# Altium schematic sheet CAN.SchDoc
size A; SheetNumber: 3; SheetTotal: 8
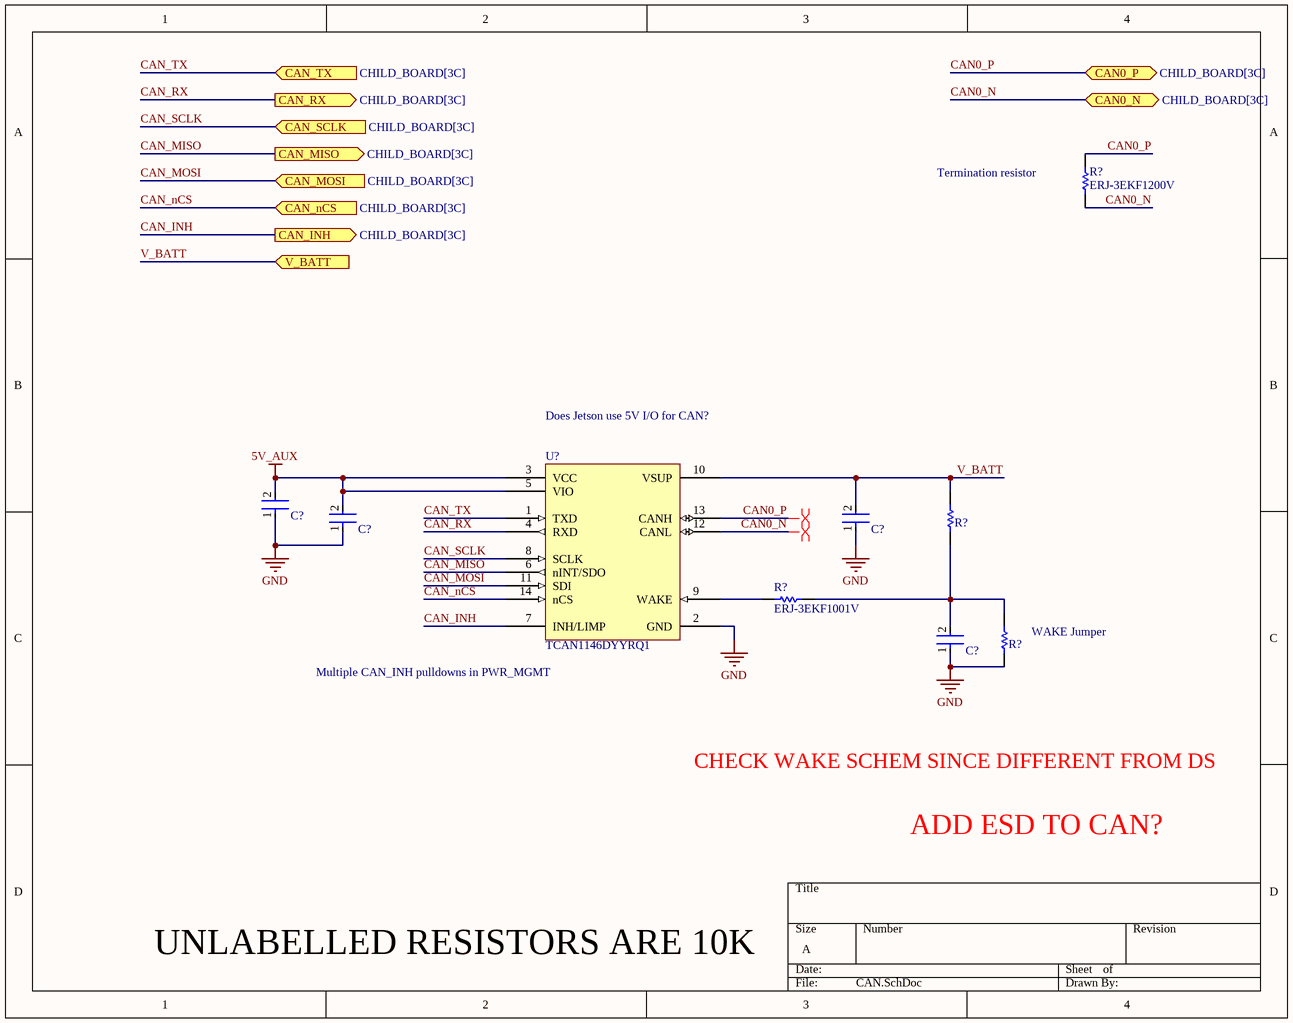
[diagram p0: CAN.SchDoc]

## Parts
(Parts that share a designator on the sheet are numbered #1, #2 ... from top to bottom, then left to right.)
C?#1  C0402C104K8PACTU  [FP-C0402-BB-MFG]  (value not drawn)
C?#2  C0402C104K8PACTU  [FP-C0402-BB-MFG]  (value not drawn)
C?#3  C0402C104K8PACTU  [FP-C0402-BB-MFG]  (value not drawn)
C?#4  C0402C104K8PACTU  [FP-C0402-BB-MFG]  (value not drawn)
R?#1  ERJ-3EKF1200V  [RESC1609X55X30ML15T15]
R?#2  ERJ3EKF1002V  [RESC1609X55X30LL15T15]  (value not drawn)
R?#3  ERJ-3EKF1001V  [RESC1608X55X30LL15T15]
R?#4  0402 JUMPER 0 OHM  [RESC1005X40X25NL05T05]  (value not drawn)
U?  TCAN1146DYYRQ1  [TCAN1146DYYRQ1-Footprint-1]

## Ports
CAN0_N (bidir, see CHILD_BOARD[3C]), CAN0_P (bidir, see CHILD_BOARD[3C]), CAN_INH (out, see CHILD_BOARD[3C]), CAN_MISO (out, see CHILD_BOARD[3C]), CAN_MOSI (in, see CHILD_BOARD[3C]), CAN_nCS (in, see CHILD_BOARD[3C]), CAN_RX (out, see CHILD_BOARD[3C]), CAN_SCLK (in, see CHILD_BOARD[3C]), CAN_TX (in, see CHILD_BOARD[3C]), V_BATT (in)

## Nets
5V_AUX: C?#1.2 C?#2.2 U?.3(VCC) U?.5(VIO)
GND: C?#1.1 C?#2.1 C?#3.1 C?#4.1 R?#4.1 U?.2(GND)
CAN0_N: R?#1.1 U?.12(CANL) ; port CAN0_N
CAN0_P: R?#1.2 U?.13(CANH) ; port CAN0_P
CAN_INH: U?.7(INH/LIMP) ; port CAN_INH
CAN_MISO: U?.6(nINT/SDO) ; port CAN_MISO
CAN_MOSI: U?.11(SDI) ; port CAN_MOSI
CAN_nCS: U?.14(nCS) ; port CAN_nCS
CAN_RX: U?.4(RXD) ; port CAN_RX
CAN_SCLK: U?.8(SCLK) ; port CAN_SCLK
CAN_TX: U?.1(TXD) ; port CAN_TX
V_BATT: C?#3.2 R?#2.1 U?.10(VSUP) ; port V_BATT
NetC?#4_2: C?#4.2 R?#2.2 R?#3.2 R?#4.2
NetR?#3_1: R?#3.1 U?.9(WAKE)

## Layout directives
differential pair: CAN0_N, CAN0_P

## Notes on the sheet
- (near R?#1) Termination resistor
- Does Jetson use 5V I/O for CAN?
- (near R?#4) WAKE Jumper
- (near U?) Multiple CAN_INH pulldowns in PWR_MGMT
- CHECK WAKE SCHEM SINCE DIFFERENT FROM DS
- ADD ESD TO CAN?
- UNLABELLED RESISTORS ARE 10K

## Library data of the parts
C?#1-C?#4 = CMP-2008-02046-2: CAP CER 0.1UF 10V X5R 0402; Manufacturer: Kemet; Material: Ceramic; Capacitance: 0.10 μF; Temperature Coefficient: 15%; Tolerance: 0.1; Value: 0.10 μF; Package: C0402-BB; Temperature: -55°C to +125°C; ComponentLink2Description: Datasheet; Temperature Characteristic: X5R; Device Class L1: Passive Components; Height: 0.55mm; Lead Free: Yes; ComponentLink2URL: https://content.kemet.com/datasheets/KEM_C1002_X7R_SMD.pdf; Device Class L2: Capacitors; Temperature Range Low: -55°C; Temperature Range High: +125°C; RoHS: TRUE; Octopart: https://octopart.com/c0402c104k8pactu-kemet-140039; Automotive: No; Mouser Description: Capacitor 100 nF 10 VDC 0402; Category: Cap; Voltage Rating: 10 V; Digikey Description: CAP CER 0.1UF 10V X5R 0402; Ipc Land Pattern Name: CAPC10050X50; Device Class L3: Ceramic Capacitors; Manufacturer Part Number: C0402C104K8PACTU
R?#1 = CMP-2000-00213-2: Chip Resistor, 120 Ohm, +/- 1%, 0.1 W, -55 to 155 degC, 0603 (1608 Metric), RoHS, Tape and Reel; Manufacturer: Panasonic; Power Rating: 100mW; Voltage Rating (DC): 75V; Resistance: 120Ohm; Temperature Coefficient: 100ppm/degreesC; Number of Terminations: 2; Military Standard: Not; Tolerance: 1%; Min Operating Temperature: -55degC; Packaging: TapeandReel; Lead Free: LeadFree; Max Operating Temperature: 155degC; Manufacturer URL: http://www.panasonic.com/; Case Code (Imperial): 0603; REACH SVHC: NoSVHC; Width: 0.031inch; Datasheet URL: https://industrial.panasonic.com/cdbs/www-data/pdf/RDA0000/AOA0000C283.pdf; RoHSCompliant: true; Max Power Dissipation: 100mW; Termination: SMD/SMT; Package Reference: 0603; Height: 0.022inch; Depth: 0.8mm; Package Description: 2-Pin Surface Mount Device, Body 1.6 x 0.85 mm; Contact Plating: Tin; Length: 1.6mm; Package URL: http://www.st.com/st-web-ui/static/active/en/resource/technical/document/datasheet/CD00001320.pdf; Radiation Hardening: No; Package Quantity: 1; Number of Pins: 2; Datasheet Version: 42095.0; Voltage Rating: 75V; Composition: ThickFilm; Case/Package: 0603; Mount: SurfaceMount; Case Code (Metric): 1608
R?#2 = CMP-1012-00623-3: Chip Resistor, 10 KOhm, +/- 1%, 0.1 W, -55 to 155 degC, 0603 (1608 Metric), RoHS, Tape and Reel; Manufacturer: Panasonic; Voltage Rating: 75V; Case\/Package: 0603; Power Rating: 100mW; Resistance: 10KOhm; Temperature Coefficient: 100ppm\/degreesC; Number of Pins: 2; Package Reference: 603; Depth: 0.8mm; Mount: SurfaceMount; Package Description: 2-Pin Surface Mount Device, Body 1.6 x 0.85 mm; Datasheet Version: 02/2017; Length: 1.6mm; Lead Free: LeadFree; Height: 0.45mm; Number of Terminations: 2; Max Power Dissipation: 100mW; Min Operating Temperature: -55degC; Datasheet URL: https://industrial.panasonic.com/cdbs/www-data/pdf/RDA0000/AOA0000C304.pdf; Termination: SMD/SMT; Case Code (Metric): 1608; Case Code (Imperial): 0603; Tolerance: 1%; Max Operating Temperature: 155degC; RoHSCompliant: true; Voltage Rating (DC): 75V; Radiation Hardening: No; Packaging: TapeandReel; Composition: ThickFilm; Mounting Technology: SurfaceMount; Manufacturer URL: http://www.panasonic.com/; Width: 0.031inch; REACH SVHC: NoSVHC; Contact Plating: Tin; Military Standard: Not; Package Quantity: 1
R?#3 = CMP-2000-00180-1: Manufacturer: Panasonic; Part Number: ERJ-3EKF1001V
R?#4 = CMP-009-00206-2: READ THE NAME
U? = CMP-015-00012-2: Automotive CAN FD transceiver with watchdog, bus diagnostics and partial networking via sele 14-SOT-23-THIN -40 to 150